# Altium schematic sheet Fuente3V.SchDoc
size Letter; ApprovedBy: M. en C. Fernando Bolaños; CheckedBy: M. en C. José Alberto Balderas Castillo (CID); Author: M. en C. José Alberto Balderas Castillo (CID); Revision: v1; NombreTarjeta: TELCOMGPRS-v1; NumeroDeHoja: 2 de 7; NombreBloque: Fuente de alimentacion de 3.3V de bajo consumo; FechaDiseno: 02-Junio-2015; FechaRevision: 05-Junio-2015; FechaAprobacion: 16-Junio-2015; TamanoHoja: Carta; NombreProyecto: Telemetria GPRS de Bajo Consumo de Energia
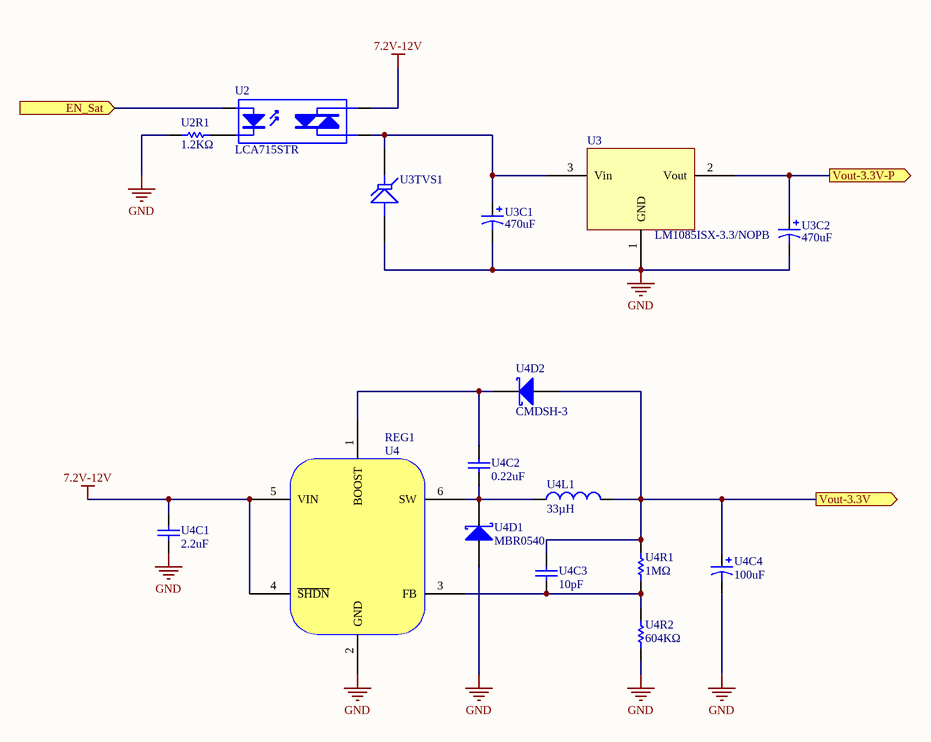
[diagram p0: Fuente3V.SchDoc]

## Parts
U2  LCA715STR  [SOP-6]
U2R1  1.2KΩ  [0805-RES]
U3  LM1085ISX-3.3/NOPB  [D2PAK3-TO263]
U3C1  470uF  [CAP-12.5X20X5]
U3C2  470uF  [CAP-12.5X20X5]
U3TVS1  20V  [DO-219AB]  (value not drawn)
U4  REG1  [SOT23-6]
U4C1  2.2uF  [1206-cap]
U4C2  0.22uF  [1206-CAP]
U4C3  10pF  [1206-CAP]
U4C4  100uF  [7343-31]
U4D1  MBR0540  [SOD-123]
U4D2  CMDSH-3  [SOD-323]
U4L1  33µH  [784774033]
U4R1  1MΩ  [0805-RES]
U4R2  604KΩ  [0805-RES]

## Ports
EN_Sat (in), Vout-3.3V (out), Vout-3.3V-P (out)

## Nets
7.2V-12V: U2.6(A/K) U4.4(~{SHDN}) U4.5(VIN) U4C1.2
GND: U2R1.1 U3.1(GND) U3C1.2 U3C2.2 U3TVS1.1(A) U4.2(GND) U4C1.1 U4C4.2 U4D1.1(A) U4R2.1
EN_Sat: U2.1(A) ; port EN_Sat
Vout-3.3V: U4C3.2 U4C4.1 U4D2.1(A) U4L1.2 U4R1.2 ; port Vout-3.3V
Vout-3.3V-P: U3.2(Vout) U3C2.1 ; port Vout-3.3V-P
NetU2_2: U2.2(K) U2R1.2
NetU2_4: U2.4(A/K) U3.3(Vin) U3C1.1 U3TVS1.2(K)
NetU4_1: U4.1(BOOST) U4C2.2 U4D2.2(K)
NetU4_3: U4.3(FB) U4C3.1 U4R1.1 U4R2.2
NetU4_6: U4.6(SW) U4C2.1 U4D1.2(K) U4L1.1

## Notes on the sheet
- Elaboró
- Fecha
- Nombre del artículo
- Revisó
- Aprobó
- Número de parte
- Revisión
- Escala
- N/A
- Sección afectada
- Descripción del cambio
- Lámina
- 1/1
- Tolerancias
- Ruta del archivo

## Library data of the parts
U2 = Opto TRIAC: RELAY OPTOMOS 1.8A SPST-NO 6-SMD; Manufacturer: IXYS Integrated Circuits Division; Supplier 1: Digi-Key; Supplier Part Number 1: CLA309CT-ND; Manufacturer Part Number: LCA715STR; Supplier 2: Mouser; Supplier Part Number 2: 849-LCA715STR
U2R1 = Res1: RES SMD 1.2K OHM 1% 1/8W 0805; Manufacturer: Panasonic Electronic Components; Manufacturer Part Number: ERJ-6ENF1201V; Value: 1.2KΩ; Supplier 1: Digi-Key; Supplier Part Number 1: P1.20KCCT-ND
U3 = LD1117A: Linear Voltage Regulator IC Positive Fixed 1 Output 3.3V 3A DDPAK/TO-263-3; Manufacturer: Texas Instruments; Supplier 1: Digi-Key; Supplier Part Number 1: LM1085ISX-3.3/NOPBCT-ND; Manufacturer Part Number: LM1085ISX-3.3/NOPB
U3C1 U3C2 = Cap Pol1: 470µF 50V Aluminum Capacitors Radial, Can 27 mOhm @ 100kHz 5000 Hrs @ 105°C; Manufacturer: Kemet; Manufacturer Part Number: ESY477M050AL3AA; Value: 470uF; Supplier 1: Digi-Key; Supplier Part Number 1: 399-6129-ND
U3TVS1 = Tranzorb: TVS DIODE 18V 29.2V SMF; Manufacturer: Vishay Semiconductor Diodes Division; Manufacturer Part Number: SMF18A-E3-08; Supplier 1: Digi-Key; Supplier Part Number 1: SMF18A-E3-08CT-ND
U4 = LT1934: LINEAR TECHNOLOGY  LT1934  IC REG BUCK ADJ 0.3A SOT23-6; Manufacturer: Linear Technology/Analog Devices; Manufacturer Part Number: LT1934; Supplier 1: Digi-Key; Supplier Part Number 1: LT1934ES6#TRMPBFCT-ND
U4C1 = Cap: CAP CER 2.2UF 50V 10% X5R 1206; Manufacturer: Taiyo Yuden; Manufacturer Part Number: UMK316BJ225KD-T; Value: 2.2uF; Supplier 1: Digi-Key; Supplier Part Number 1: 587-2402-1-ND
U4C2 = Cap: CAP CER 0.22UF 50V 10% X7R 1206; Manufacturer: Samsung Electro-mechanics; Manufacturer Part Number: CL31B224KBFNNNE; Value: 0.22uF; Supplier 1: Digi-Key; Supplier Part Number 1: 1276-1106-1-ND
U4C3 = Cap: CAP CER 10PF 50V 10% NP0 1206; Manufacturer: Kemet; Manufacturer Part Number: C1206C100K5GACTU; Value: 10pF; Supplier 1: Digi-Key; Supplier Part Number 1: 399-9297-1-ND
U4C4 = Cap Pol1: CAP TANT 100UF 16V 10% 2917; Manufacturer: Kemet; Manufacturer Part Number: T495D107K016AHE125; Value: 100uF; Supplier 1: Digi-Key; Supplier Part Number 1: 399-8498-1-ND
U4D1 = D Schottky: DIODE SCHOTTKY 40V 500MA SOD123; Manufacturer: Micro Commercial Co; Manufacturer Part Number: MBR0540-TP; Supplier 1: Digi-Key; Supplier Part Number 1: MBR0540TPMSCT-ND
U4D2 = D Schottky: DIODE SCHOTTKY 30V 100MA SOD323; Manufacturer: Central Semiconductor Corp; Manufacturer Part Number: CMDSH-3 TR; Supplier 1: Digi-Key; Supplier Part Number 1: CMDSH-3 CT-ND
U4L1 = Inductor: WE-PD2A SMD Power Inductor; Manufacturer: Wurth Elektronik; Manufacturer Part Number: 784774133; Value: 33µH; Supplier Part Number 1: 784774133; Supplier 1: Wurth Elektronik
U4R1 = Res1: RES SMD 1M OHM 0.1% 1/8W 0805; Manufacturer: Panasonic Electronic Components; Manufacturer Part Number: ERA-6AEB105V; Value: 1MΩ; Supplier 1: Digi-Key; Supplier Part Number 1: P1MDACT-ND
U4R2 = Res1: RES SMD 604K OHM 0.1% 1/8W 0805; Manufacturer: Yageo; Manufacturer Part Number: RT0805BRD07604KL; Value: 604KΩ; Supplier 1: Digi-Key; Supplier Part Number 1: YAG1941CT-ND